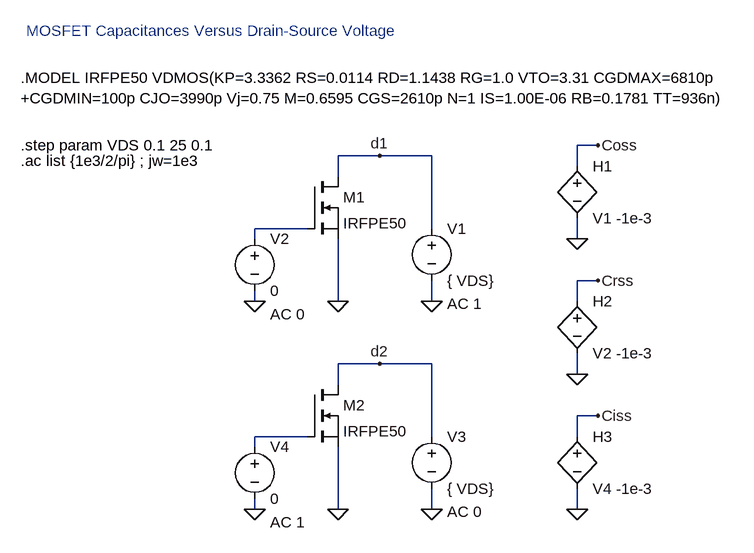
[diagram p0: schematic IRFPE50_Cxss.asc]
IRFPE50_Cxss.asc, the LTspice schematic file:
Version 4
SHEET 1 1084 788
WIRE 512 96 480 96
WIRE 176 112 112 112
WIRE 256 112 176 112
WIRE 480 128 480 96
WIRE 112 144 112 112
WIRE 64 224 -16 224
WIRE 256 224 256 112
WIRE -16 240 -16 224
WIRE 480 240 480 208
WIRE 512 304 480 304
WIRE -16 336 -16 320
WIRE 112 336 112 240
WIRE 256 336 256 304
WIRE 480 336 480 304
WIRE 176 432 112 432
WIRE 256 432 176 432
WIRE 480 448 480 416
WIRE 112 464 112 432
WIRE 512 512 480 512
WIRE 64 544 -16 544
WIRE 256 544 256 432
WIRE 480 544 480 512
WIRE -16 560 -16 544
WIRE -16 656 -16 640
WIRE 112 656 112 560
WIRE 256 656 256 624
WIRE 480 656 480 624
FLAG 112 336 0
FLAG -16 336 0
FLAG 256 336 0
FLAG 176 112 d1
FLAG 112 656 0
FLAG -16 656 0
FLAG 256 656 0
FLAG 176 432 d2
FLAG 480 240 0
FLAG 480 448 0
FLAG 480 656 0
FLAG 512 96 Coss
FLAG 512 304 Crss
FLAG 512 512 Ciss
SYMBOL NMOS 64 144 R0
SYMATTR InstName M1
SYMATTR Value IRFPE50
SYMBOL voltage 256 208 R0
WINDOW 123 24 132 Left 0
WINDOW 39 0 0 Left 0
SYMATTR Value2 AC 1
SYMATTR InstName V1
SYMATTR Value { VDS}
SYMBOL voltage -16 224 R0
WINDOW 123 24 132 Left 0
WINDOW 39 0 0 Left 0
SYMATTR Value2 AC 0
SYMATTR InstName V2
SYMATTR Value 0
SYMBOL NMOS 64 464 R0
SYMATTR InstName M2
SYMATTR Value IRFPE50
SYMBOL voltage 256 528 R0
WINDOW 123 24 132 Left 0
WINDOW 39 0 0 Left 0
SYMATTR Value2 AC 0
SYMATTR InstName V3
SYMATTR Value { VDS}
SYMBOL voltage -16 544 R0
WINDOW 123 24 132 Left 0
WINDOW 39 0 0 Left 0
SYMATTR Value2 AC 1
SYMATTR InstName V4
SYMATTR Value 0
SYMBOL h 480 112 R0
SYMATTR InstName H1
SYMATTR Value V1 -1e-3
SYMBOL h 480 320 R0
SYMATTR InstName H2
SYMATTR Value V2 -1e-3
SYMBOL h 480 528 R0
SYMATTR InstName H3
SYMATTR Value V4 -1e-3
TEXT -376 -8 Left 0 !.MODEL IRFPE50 VDMOS(KP=3.3362 RS=0.0114 RD=1.1438 RG=1.0 VTO=3.31 CGDMAX=6810p\n+CGDMIN=100p CJO=3990p Vj=0.75 M=0.6595 CGS=2610p N=1 IS=1.00E-06 RB=0.1781 TT=936n)
TEXT -376 96 Left 0 !.step param VDS 0.1 25 0.1
TEXT -376 120 Left 0 !.ac list {1e3/2/pi} ; jw=1e3
TEXT -368 -80 Left 0 ;MOSFET Capacitances Versus Drain-Source Voltage

The netlist it stands for:
* IRFPE50_Cxss.asc
M1 d1 N001 0 0 IRFPE50
V1 d1 0 { VDS} AC 1
V2 N001 0 0 AC 0
M2 d2 N002 0 0 IRFPE50
V3 d2 0 { VDS} AC 0
V4 N002 0 0 AC 1
H1 Coss 0 V1 -1e-3
H2 Crss 0 V2 -1e-3
H3 Ciss 0 V4 -1e-3
.model NMOS NMOS
.model PMOS PMOS
.lib standard.mos
.MODEL IRFPE50 VDMOS(KP=3.3362 RS=0.0114 RD=1.1438 RG=1.0 VTO=3.31 CGDMAX=6810p
+CGDMIN=100p CJO=3990p Vj=0.75 M=0.6595 CGS=2610p N=1 IS=1.00E-06 RB=0.1781 TT=936n)
.step param VDS 0.1 25 0.1
.ac list {1e3/2/pi} ; jw=1e3
* MOSFET Capacitances Versus Drain-Source Voltage
.backanno
.end